# Altium schematic sheet 5V_Regulator.SchDoc
size A4; SheetNumber: 3; SheetTotal: 4
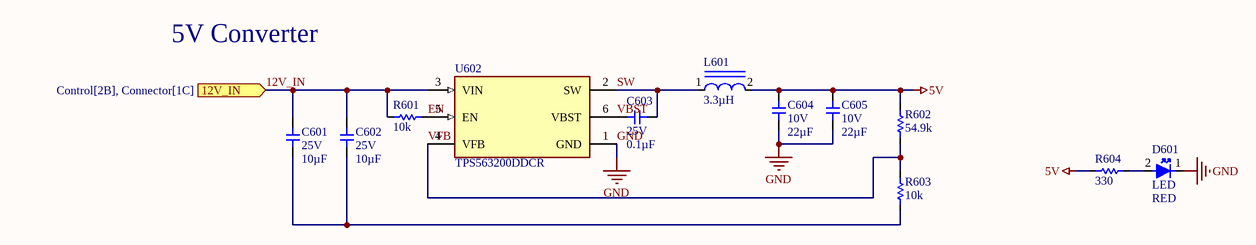
[diagram p0: 5V_Regulator.SchDoc]

## Parts
C601  Voltage: 25V  Capacitance: 10µF  [0805]  (hidden comment: non-polar_Capacitor)
C602  Voltage: 25V  Capacitance: 10µF  [0805]  (hidden comment: non-polar_Capacitor)
C603  Voltage: 25V  Capacitance: 0.1µF  [0805]  (hidden comment: non-polar_Capacitor)
C604  Voltage: 10V  Capacitance: 22µF  [0805]  (hidden comment: non-polar_Capacitor)
C605  Voltage: 10V  Capacitance: 22µF  [0805]  (hidden comment: non-polar_Capacitor)
D601  LED  Color: RED  [SMD_LED]
L601  Inductance: 3.3µH  [FP-SRP7030CA-MFG]  (hidden comment: inductor_SRP7030CA)
R601  Resistance: 10k  [0805]  (hidden comment: Resistor)
R602  Resistance: 54.9k  [0805]  (hidden comment: Resistor)
R603  Resistance: 10k  [0805]  (hidden comment: Resistor)
R604  Resistance: 330  [SMD_Resistor]  (hidden comment: Resistor)
U602  TPS563200DDCR  [FP-DDC0006A-MFG]

## Ports
12V_IN (in, see Control[2B], Connector[1C])

## Nets
5V: C604.2 C605.2 L601.2 R602.2 R604.1
GND: C604.1 C605.1 D601.1 U602.1(GND)
12V_IN: C601.2 C602.2 R601.1 U602.3(VIN) ; port 12V_IN
EN: R601.2 U602.5(EN)
SW: C603.2 L601.1 U602.2(SW)
VBST: C603.1 U602.6(VBST)
VFB: R602.1 R603.2 U602.4(VFB)
NetC601_1: C601.1 C602.1 R603.1
NetD601_2: D601.2 R604.2

## Notes on the sheet
- 5V Converter

## Library data of the parts
C601-C605 = CMP-024-000020-15: SMD type ceramic capacitor; Design Item ID: Capacitor; Source: robit_passive.SchLib
D601 = CMP-026-000008-1: Light Emitting Diode; Design Item ID: LED; Source: robit_passive.SchLib
L601 = CMP-028-000006-1: General Purpose Inductor, 6.8uH, 20%, 1 Element, Powdered Metal Alloy-Core, SMD, 3130
R601-R603 = CMP-029-000004-8: SMD type resistor; Design Item ID: Resistor; Source: robit_passive.SchLib
R604 = CMP-029-000004-1: SMD type resistor; Design Item ID: Resistor; Source: robit_passive.SchLib
U602 = CMP-04918-000155-1: IC REG BUCK ADJ 3A TSOT23-6; Quiescent Current: 190uA; Output Voltage: 7V; Min Input Voltage: 4.5V; Output Configuration: Positive; Number of Outputs: 1; Switching Frequency: 650kHz; Synchronous Rectifier: Yes; Min Output Voltage: 760mV; Output Type: Adjustable; Operating Supply Voltage: 17V; Max Operating Temperature: 125°C; Lead Free: Lead Free; Packaging: Tape and Reel; Radiation Hardening: No; Mount: Surface Mount; Contact Plating: Tin; Output Current: 3A; Max Output Voltage: 7V; Min Operating Temperature: -40°C; Case/Package: SOT-23-6; Max Output Current: 3A; Max Input Voltage: 17V